# EAGLE design rcvr003 (EAGLE 6.2)
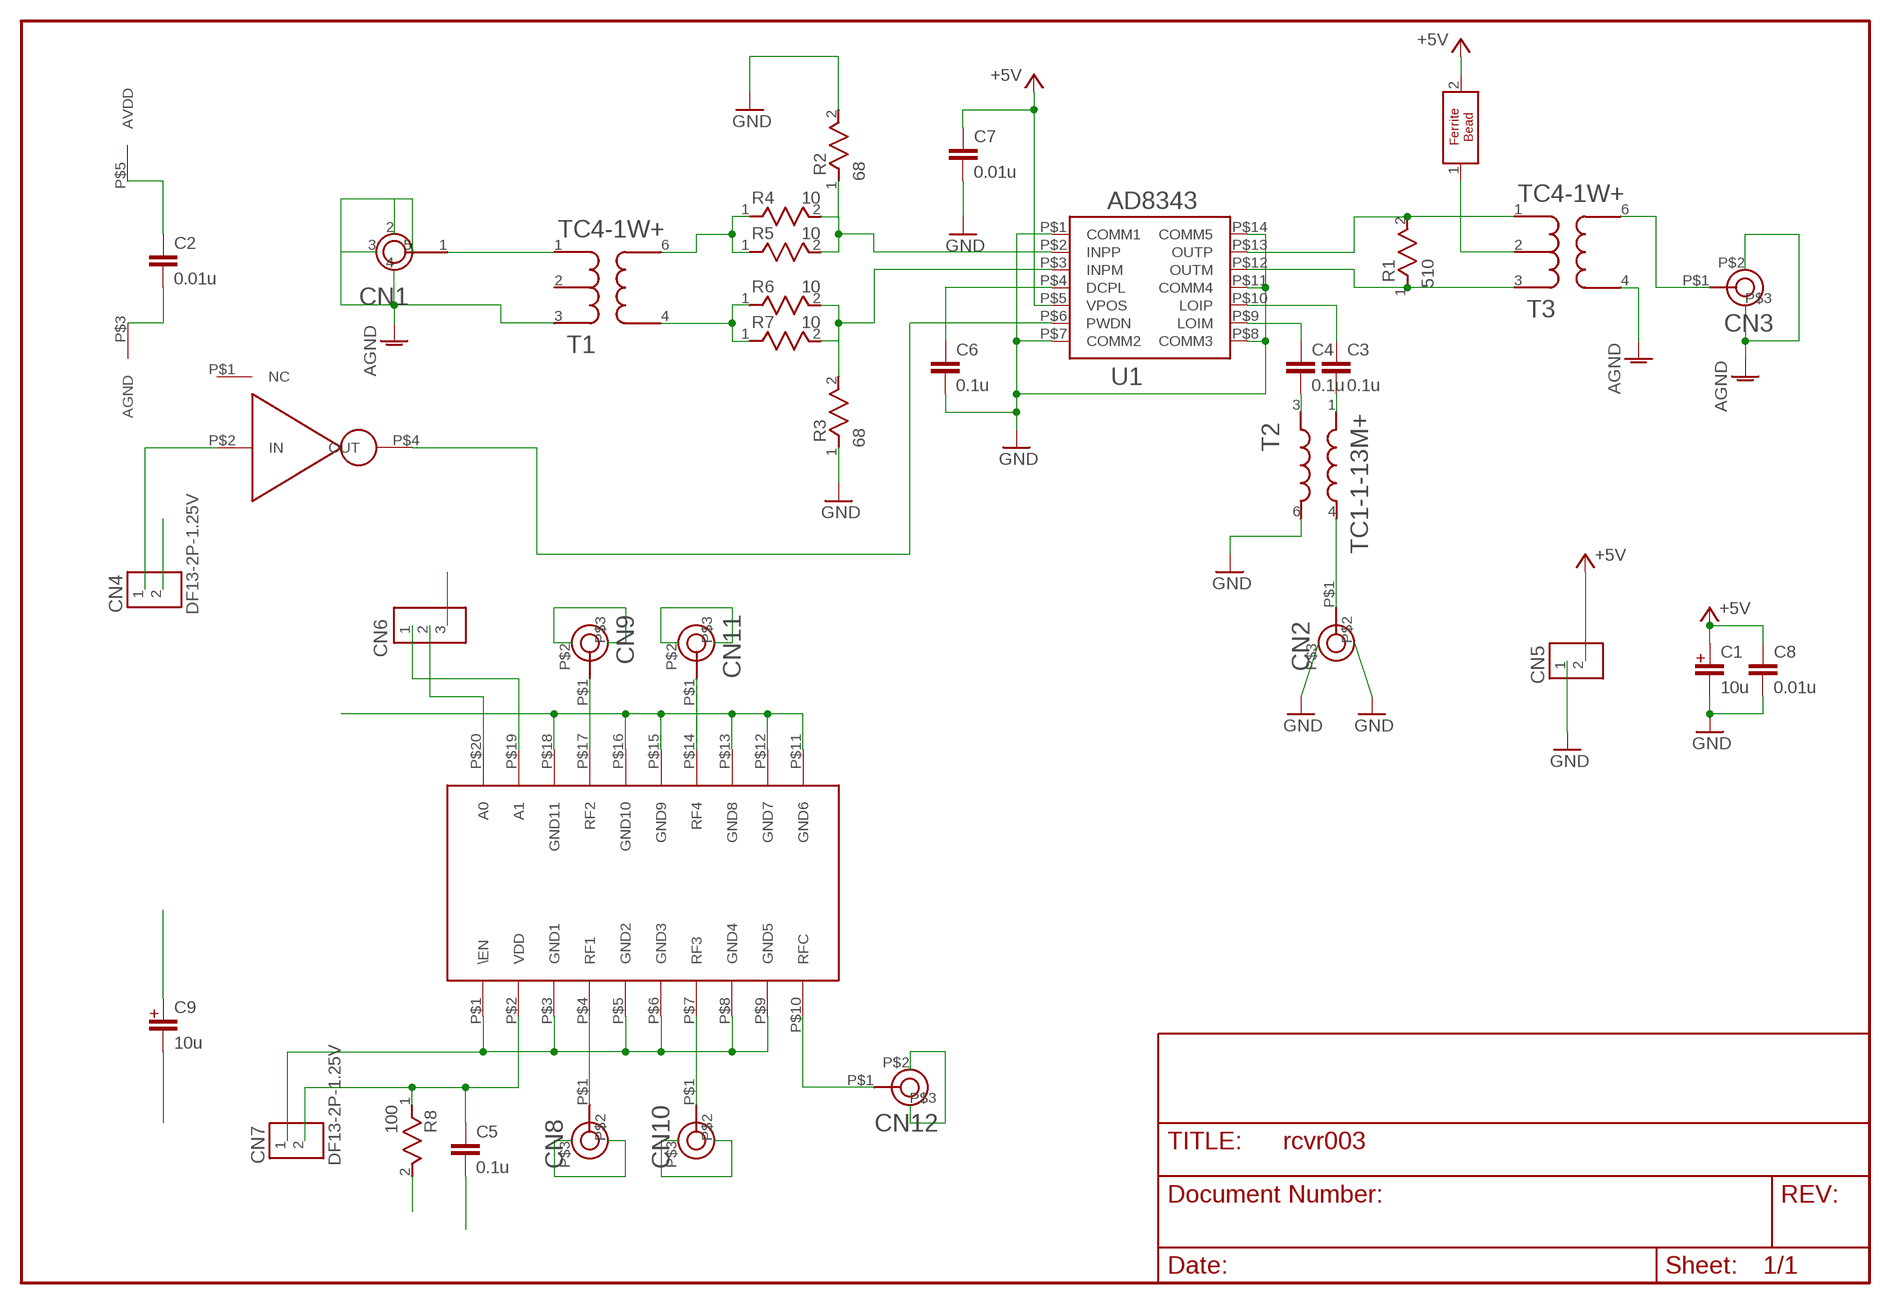
[diagram p0: schematic, sheet 1]

## Parts
C1  10u  C_POLAR3216  [3216_POLAR]
C2  0.01u  C1005  [1005]
C3  0.1u  C1005  [1005]
C4  0.1u  C1005  [1005]
C5  0.1u  C1005  [1005]
C6  0.1u  C1005  [1005]
C7  0.01u  C1005  [1005]
C8  0.01u  C1608  [1608]
C9  10u  C_POLAR3216  [3216_POLAR]
CN1  SMASTRAIGHT  [SMA_STRAIGHT]
CN2  U.FL-R-SMT  [U.FL-R-SMT]
CN3  U.FL-R-SMT  [U.FL-R-SMT]
CN4  DF13-2P-1.25V  [DF13-2P-12.5V]
CN5  DF13-2P-1.25V  [DF13-2P-12.5V]
CN6  DF13-3P-1.25V  [DF13-3P-1.25V]
CN7  DF13-2P-1.25V  [DF13-2P-12.5V]
CN8  U.FL-R-SMT  [U.FL-R-SMT]
CN9  U.FL-R-SMT  [U.FL-R-SMT]
CN10  U.FL-R-SMT  [U.FL-R-SMT]
CN11  U.FL-R-SMT  [U.FL-R-SMT]
CN12  U.FL-R-SMT  [U.FL-R-SMT]
FB2  FERRITEBEAD  [1608]
R1  510  R1608  [1608]
R2  68  R1608  [1608]
R3  68  R1608  [1608]
R4  10  R1005  [1005]
R5  10  R1005  [1005]
R6  10  R1005  [1005]
R7  10  R1005  [1005]
R8  100  R1608  [1608]
T1  TC4-1W+  [AT224]
T2  TC1-1-13M+  [AT224]
T3  TC4-1W+  [AT224]
U1  AD8343  [AD8343]
U2  MC74VHC1G04  [MC74VHC1G04]
U3  ADG904  [ADG904_TSSOP]

## Nets
3.3V: C5.1 C9.1 CN7.2 R8.1 U3.P$2(VDD)
+5V: C1.1 C2.1 C7.1 C8.1 CN5.2 FB2.2 U1.P$5(VPOS) U2.P$5(AVDD)
AGND: C1.2 C2.2 C6.2 C7.2 C8.2 CN1.2(GND) CN1.3(GND) CN1.4(GND) CN1.5(GND) CN2.P$2(AGND) CN2.P$3(AGND2) CN3.P$2(AGND) CN3.P$3(AGND2) CN4.2 CN5.1 R2.2 R3.1 T1.3 T2.6 T3.4 U1.P$1(COMM1) U1.P$7(COMM2) U1.P$8(COMM3) U1.P$11(COMM4) U1.P$14(COMM5) U2.P$3(AGND) ; supply symbol labelled GND
GND2: C5.2 C9.2 CN7.1 CN8.P$2(AGND) CN8.P$3(AGND2) CN9.P$2(AGND) CN9.P$3(AGND2) CN10.P$2(AGND) CN10.P$3(AGND2) CN11.P$2(AGND) CN11.P$3(AGND2) CN12.P$2(AGND) CN12.P$3(AGND2) U3.P$1(\EN) U3.P$3(GND1) U3.P$5(GND2) U3.P$6(GND3) U3.P$8(GND4) U3.P$9(GND5) U3.P$11(GND6) U3.P$12(GND7) U3.P$13(GND8) U3.P$15(GND9) U3.P$16(GND10) U3.P$18(GND11)
N2: R8.2
N$1: CN4.1 U2.P$2(IN)
N$2: CN12.P$1 U3.P$10(RFC)
N$3: CN10.P$1 U3.P$7(RF3)
N$4: CN8.P$1 U3.P$4(RF1)
N$5: CN9.P$1 U3.P$17(RF2)
N$6: CN11.P$1 U3.P$14(RF4)
N$7: CN6.3
N$8: CN6.2 U3.P$20(A0)
N$9: CN2.P$1 T2.4
N$10: CN1.1 T1.1
N$11: U1.P$6(PWDN) U2.P$4(OUT)
N$12: CN6.1 U3.P$19(A1)
N$13: CN3.P$1 T3.6
N$20: FB2.1 T3.2
N$21: R1.2 T3.1 U1.P$13(OUTP)
N$22: R1.1 T3.3 U1.P$12(OUTM)
N$23: C6.1 U1.P$4(DCPL)
N$24: C4.1 U1.P$9(LOIM)
N$25: C3.1 U1.P$10(LOIP)
N$27: C4.2 T2.3
N$28: C3.2 T2.1
N$31: R2.1 R4.2 R5.2 U1.P$2(INPP)
N$32: R3.2 R6.2 R7.2 U1.P$3(INPM)
N$33: R4.1 R5.1 T1.6
N$34: R6.1 R7.1 T1.4
Unconnected: T1.2 U2.P$1(NC)

## Library data of the parts
C1 C9 = capacitor:C_POLAR
C2-C8 = capacitor:C: CAPACITOR naming: grid - package width
CN1 = connector:SMA
CN2 CN3 CN8-CN12 = HIROSE:U.FL-R-SMT
CN4 CN5 CN7 = HIROSE:DF13-2P-1.25V
CN6 = HIROSE:DF13-3P-1.25V
FB2 = ferriteBead:FERRITEBEAD
R1-R8 = resistor:R
T1 T3 = miniCircuits:TC4-1W+
T2 = miniCircuits:TC1-1-13M+
U1 = AnalogDevices:AD8343
U2 = nmr:MC74VHC1G04
U3 = nmr:ADG904

## Board
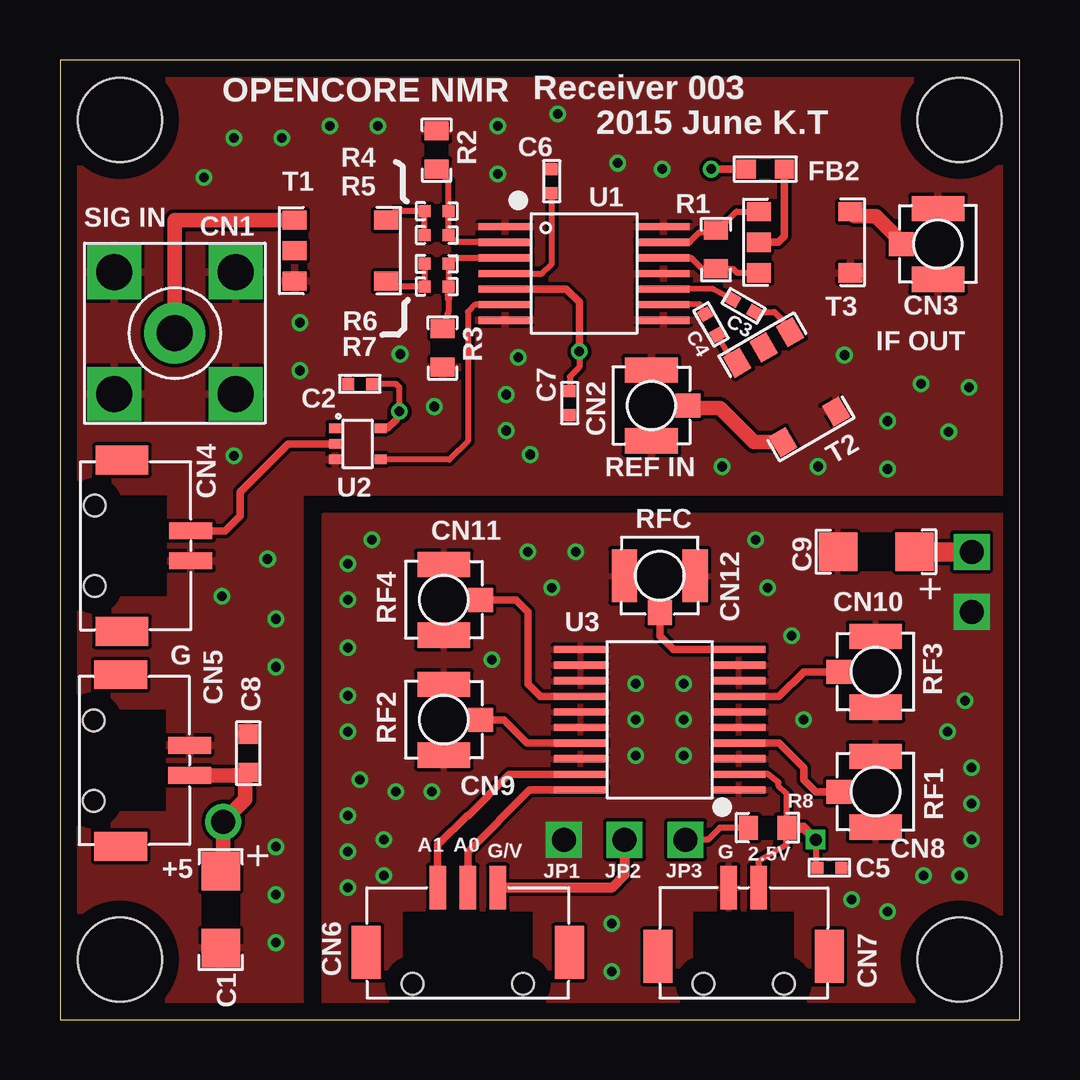
[diagram p1: board, top side]
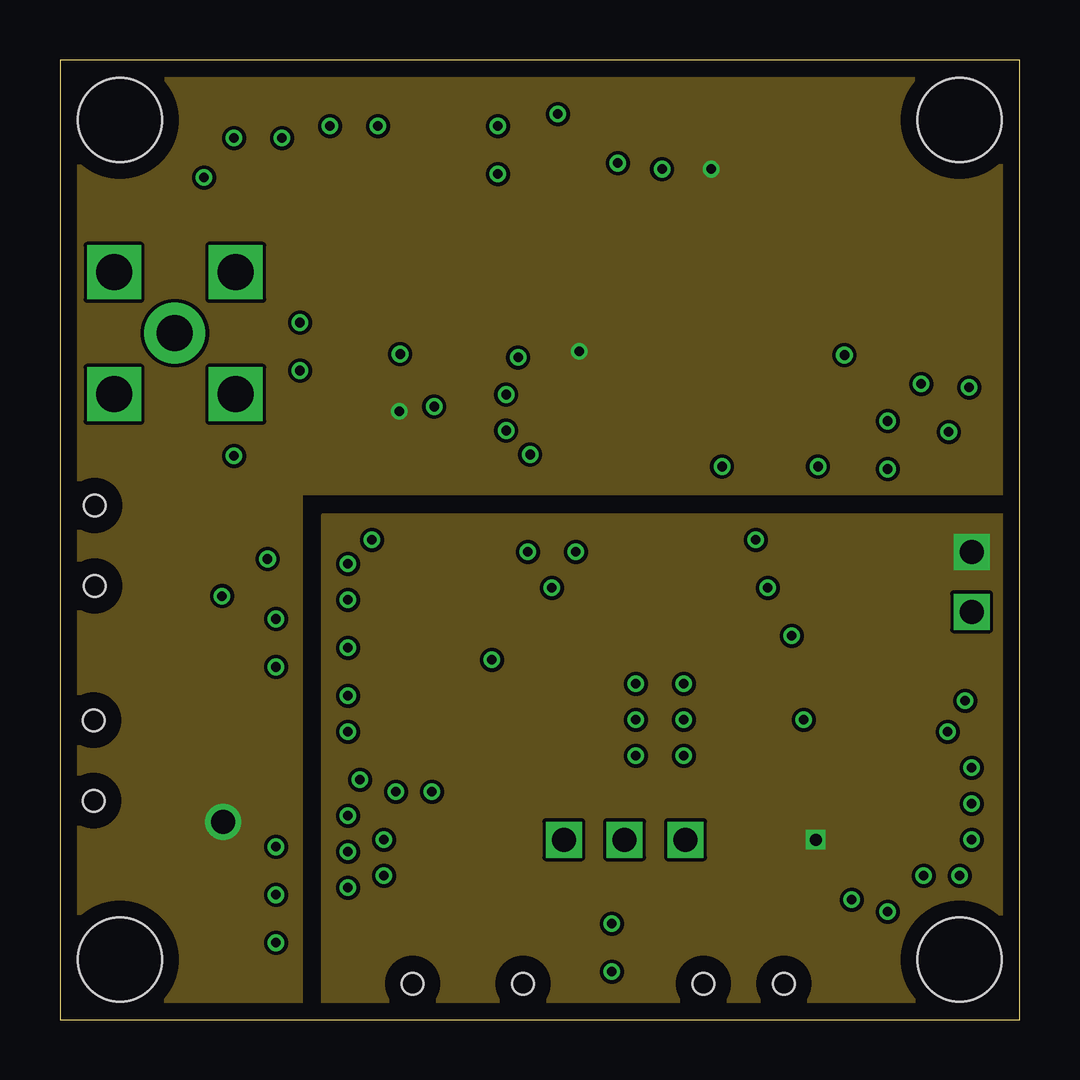
[diagram p2: board, inner layer Route2]
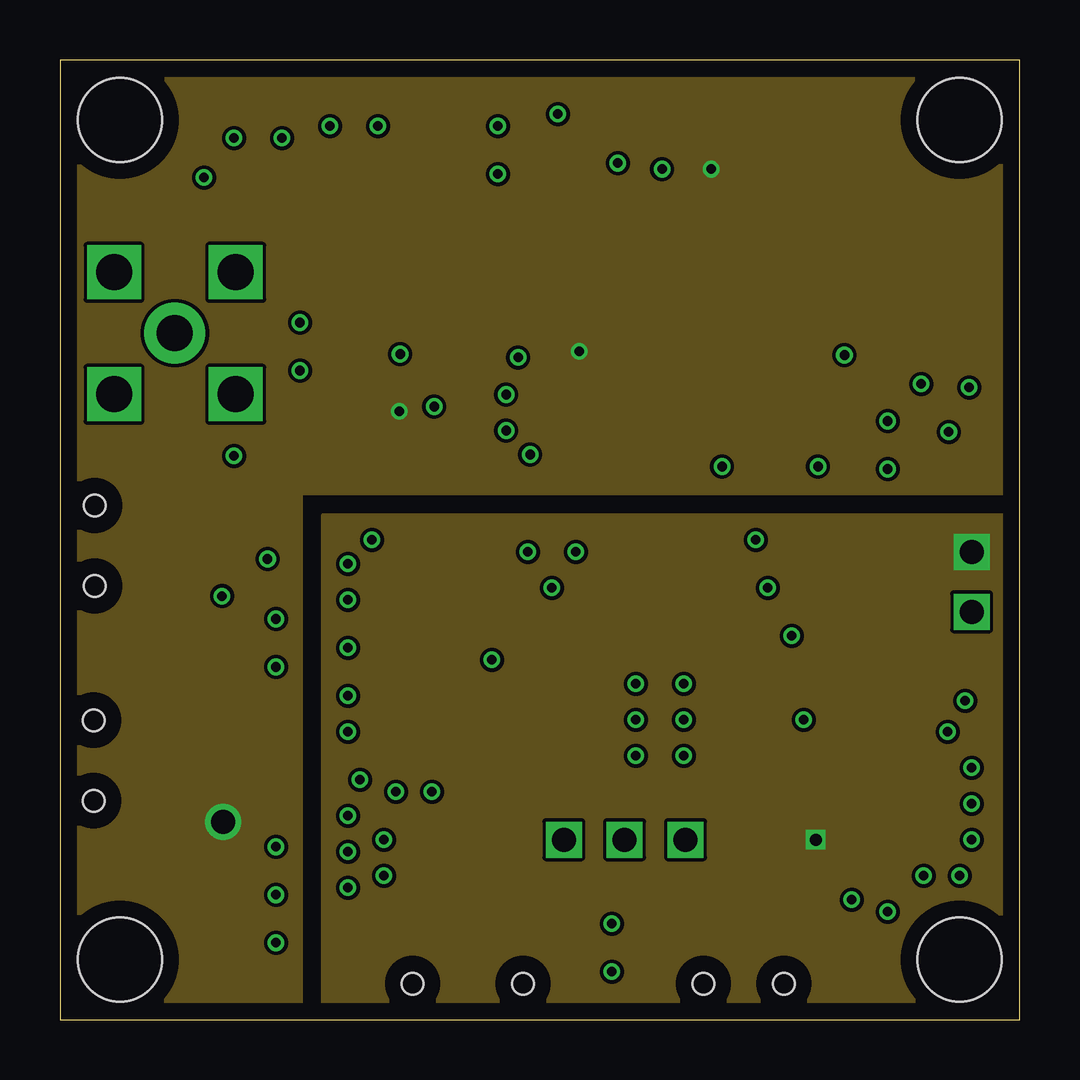
[diagram p3: board, inner layer Route3]
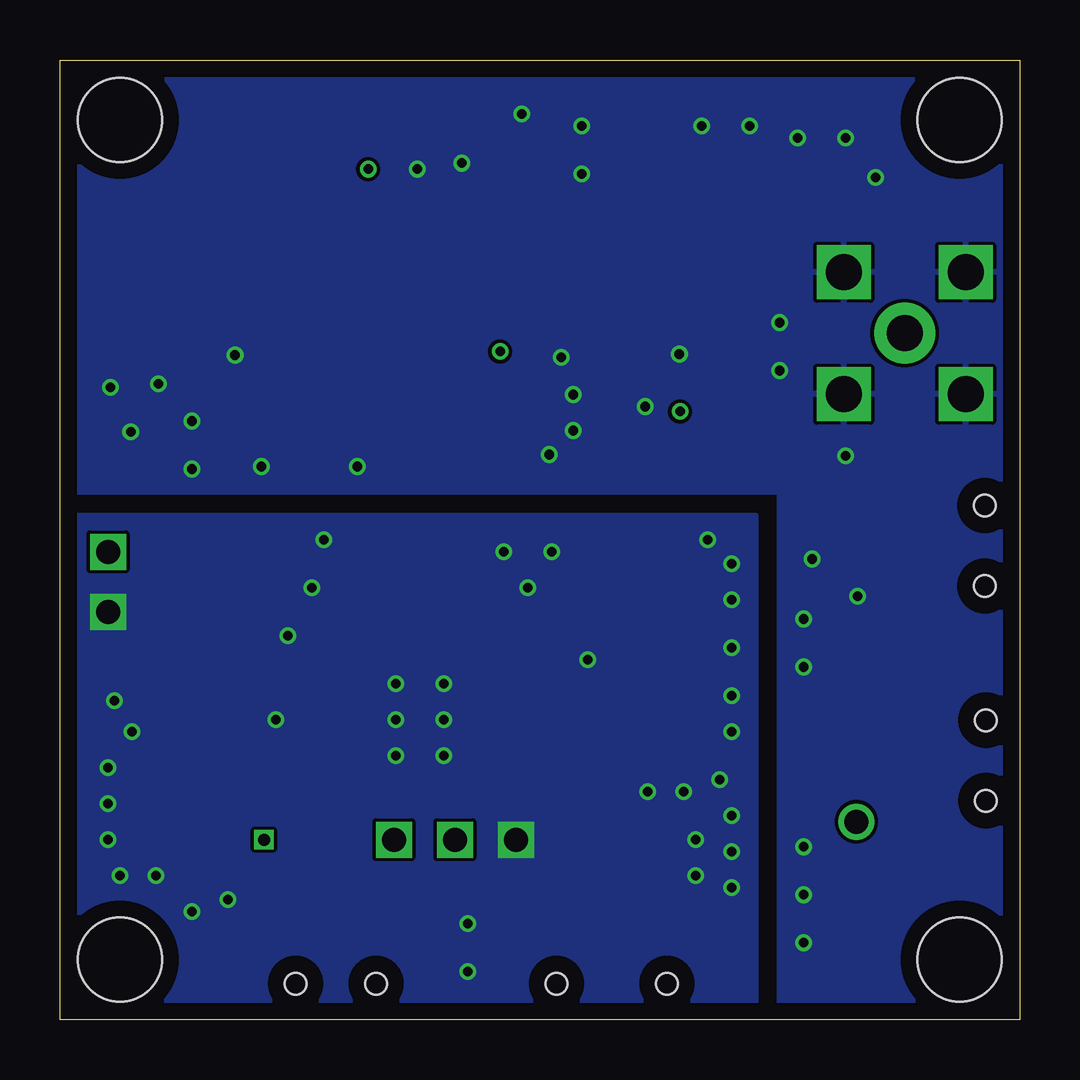
[diagram p4: board, bottom side, seen from below]

Size 40 x 40 mm. Coordinates in mm from the lower left corner, seen from the top.
Outline: 0,0 40,0 40,40 0,40 0,0
Copper layers (1*2*3*16): Top 0.035mm / dielectric 1.5mm / Route2 0.035mm / dielectric 0.15mm / Route3 0.035mm / dielectric 0.2mm / Bottom 0.035mm
Design rules: minimum track width 0.15mm, minimum drill 0.3mm, track to track 0.15mm, track to pad 0.15mm, pad to pad 0.15mm, via to via 0.15mm, smd to smd 0.15mm, copper to edge 0.7mm, drill to drill 0.45mm, minimum pad ring 0.15mm, minimum via ring 0.15mm, stop-mask expansion 4mil, vias tented up to drill 0mil, thermal gap 0.15mm
Holes 3.5 mm at 2.5,2.5 37.5,2.5 37.5,37.5 2.5,37.5

### Footprints (pad centres in the part's own frame; a part is rotated, then mirrored left to right if it is on the bottom)
3216_POLAR = smd 1.6 x 1.6: 1 -1.63,0; 2 1.57,0
1005 = smd 0.5 x 0.5: 1 -0.5,0; 2 0.5,0
1608 = smd 0.8 x 0.8: 1 -0.8,0; 2 0.8,0
SMA_STRAIGHT = drill 1.5 pad 2.54: 1 0,0 | drill 1.5 square: 2 -2.54,2.54; 3 2.54,2.54; 4 -2.54,-2.54; 5 2.54,-2.54
U.FL-R-SMT = smd 1 x 1.05: P$1 0,1.525 | smd 1.05 x 2.2: P$2 1.475,0; P$3 -1.475,0
DF13-2P-12.5V = smd 0.7 x 1.8: 1 -0.625,4; 2 0.625,4 | smd 1.2 x 2.2: 3 -3.575,1.13; 4 3.575,1.13 | hole 0.9: -1.675,0; 1.675,0
DF13-3P-1.25V = smd 0.7 x 1.8: 1 -1.25,4; 2 0,4; 3 1.25,4 | smd 1.2 x 2.2: 4 -4.235,1.3; 5 4.235,1.3 | hole 0.9: -2.3,0; 2.3,0
1608' = smd 0.8 x 1: 1 -0.8,0; 2 0.8,0
AT224 = smd 1 x 0.8: 1 -1.925,1.275; 2 -1.925,0; 3 -1.925,-1.275; 4 1.9,-1.275; 6 1.9,1.275
AD8343 = smd 2.2 x 0.3: P$1 -3.3,1.95; P$2 -3.3,1.3; P$3 -3.3,0.65; P$4 -3.3,0; P$5 -3.3,-0.65; P$6 -3.3,-1.3; P$7 -3.3,-1.95; P$8 3.3,-1.95; P$9 3.3,-1.3; P$10 3.3,-0.65; P$11 3.3,0; P$12 3.3,0.65; P$13 3.3,1.3; P$14 3.3,1.95
MC74VHC1G04 = smd 0.5 x 0.4: P$1 0,0; P$2 0,-0.65; P$3 0,-1.3; P$4 1.9,-1.3; P$5 1.9,0
ADG904_TSSOP = smd 0.3 x 2.2: P$1 -2.925,-3.3; P$2 -2.275,-3.3; P$3 -1.625,-3.3; P$4 -0.975,-3.3; P$5 -0.325,-3.3; P$6 0.325,-3.3; P$7 0.975,-3.3; P$8 1.625,-3.3; P$9 2.275,-3.3; P$10 2.925,-3.3; P$11 2.925,3.3; P$12 2.275,3.3; P$13 1.625,3.3; P$14 0.975,3.3; P$15 0.325,3.3; P$16 -0.325,3.3; P$17 -0.975,3.3; P$18 -1.625,3.3; P$19 -2.275,3.3; P$20 -2.925,3.3

### Placement (x,y rotation side)
C1  6.7,4.55 270 top
C2  12.5,26.5 180 top
C3  28.5,29.75 330 top
C4  27.14,28.98 300 top
C5  32.07,6.33 0 top
C6  20.5,34.95 90 top
C7  21.25,25.7 270 top
C8  7.85,11.1 90 top
C9  34,19.5 180 top
CN1  4.79,28.61 0 top
CN2  24.65,25.6 270 top
CN3  36.6,32.33 90 top
CN4  1.45,19.75 270 top
CN5  1.4,10.8 270 top
CN6  17,1.5 0 top
CN7  28.5,1.5 0 top
CN8  34,9.5 90 top
CN9  16,12.5 270 top
CN10  34,14.5 90 top
CN11  16,17.5 270 top
CN12  25,18.5 180 top
FB2  29.4,35.45 180 top
R1  510  [1608']  27.35,32.1 90 top
R2  68  [1608']  15.7,36.25 90 top
R3  68  [1608']  15.95,28 90 top
R4  15.7,33.7 0 top
R5  15.7,32.7 0 top
R6  15.7,31.5 0 top
R7  15.7,30.55 0 top
R8  100  [1608']  29.5,8 180 top
T1  11.7,32.05 0 top
T2  30.3,26.35 300 top
T3  31.05,32.4 0 top
U1  21.85,31.1 0 top
U2  11.46,24.65 0 top
U3  25,12.5 90 top

### Tracks (layer width: path | path; a pad name or v marks a point on that pad's centre or on a via)
3.3V  (via drill 0.5, 1)
  Top 0.254: 28.3,10.2 U3.P$2 29.52,10.23 29.95,9.88 29.95,9.74 30.3,9.41 R8.1 30.29,7.3 29.11,6.62 29.11,5.51 CN7.2 | v31.5,7.5 31.5,6.4 C5.1
  Top 0.406: v31.5,7.5 31,8 R8.1
  Top 0.61: 29.1,5.53 CN7.2
  Top 0.813: v38,19.5 C9.1
  pour Route2: 40,0 11,0 11,21 40,21
  pour Route3: 40,0 11,0 11,21 40,21
+5V  (via drill 0.4, 1)
  Top 0.254: v21.65,27.85 21.65,27.2 21.25,26.8 C7.1 | C7.1 | v14.15,25.35 14.15,26.35 14,26.5 C2.1
  Top 0.305: U1.P$5 21.1,30.45 21.65,29.9 v21.65,27.85 | U2.P$5 13.65,24.65 14,25 v14.15,25.35 | v27.15,35.45 FB2.2
  Top 0.406: v21.65,27.85 21.7,27.85
  Top 0.61: CN5.2 7.72,10.18 | 7.72,10.18 C8.1 | 7.72,10.18 7.72,9.18 v6.8,8.25 6.8,6.28 C1.1
  pour Route2: 0,0 10,0 10,22 40,22 40,40 0,40
  pour Route3: 0,0 10,0 10,22 40,22 40,40 0,40
AGND  (via drill 0.4)
  other vias: 6.75,17.65 19.6,23.55 9.25,36.75 37.05,24.5 10,29.05 8.65,19.2 34.5,24.95 32.7,27.7 25.1,35.45 7.25,23.5 23.25,35.7 9,3.2 35.9,26.5 6,35.1 19.1,27.6 37.9,26.35 9,5.2 9,7.2 9,14.7 9,16.7 10,27.05 27.6,23.05 31.6,23.05 34.5,22.95 18.6,26.05 18.6,24.55 11.25,37.25 7.25,36.75 13.25,37.25 18.25,37.25 18.25,35.25 20.75,37.75 14.18,27.74 15.6,25.55
  pour Bottom: 0,0 10,0 10,22 40,22 40,40 0,40
  pour Top: 0,40 40,40 40,22 10,22 10,0 0,0
GND2  (via drill 0.4 pad 0.61, 1, 1 pad 1.27)
  other vias: 23,2 34.5,4.5 37.73,13.29 33,5 13.5,6 12,8.5 23,4 21,7.5 30.5,16 36,6 37.5,6 37.5,6 38,7.5 38,9 38,10.5 37,12 29.5,18 29,20 21.5,19.5 20.5,18 19.5,19.5 15.5,9.5 13,20 12,19 12,17.5 12,15.5 12,13.5 12,12 12.5,10 14,9.5 13.5,7.5 12,7 12,5.5 18,15 31,12.5 24,14 26,14 26,12.5 26,11 24,11 24,12.5 38,17
  pour Top: 40,21 11,21 11,0 40,0
  pour Bottom: 40,0 11,0 11,21 40,21
N2  (via drill 1)
  Top 0.254: R8.2 27.5,8 27,7.5 v26.08,7.5
N$1
  Top 0.305: CN4.1 6.88,20.38 7.5,21 7.5,22 9.5,24 U2.P$2
N$2
  Top 0.305: U3.P$10 25.57,15.43 25,16 CN12.P$1
N$3
  Top 0.305: U3.P$7 29.98,13.47 31,14.5 CN10.P$1
N$4
  Top 0.305: U3.P$4 29.98,11.53 31,10.5 31,10 31.5,9.5 CN8.P$1
N$5
  Top 0.305: U3.P$17 19.48,11.53 18.5,12.5 CN9.P$1
N$6
  Top 0.305: U3.P$14 20.02,13.47 19.5,14 19.5,17 19,17.5 CN11.P$1
N$7  (via drill 1)
  Top 0.406: v23.54,7.5 23.54,6.04 23,5.5 CN6.3
N$8
  Top 0.305: U3.P$20 19.57,9.57 17,7 CN6.2
N$9
  Top 0.61: T2.4 28.93,24.07 27.5,25.5 26.27,25.5 CN2.P$1
N$10
  Top 0.15: 9.81,33.32 T1.1
  Top 0.406: CN1.1 4.78,28.81
  Top 0.61: 9.81,33.32 4.78,33.32 4.78,28.81
N$11
  Top 0.254: U1.P$6 17.3,29.8 17,29.5 17,24.12 16.22,23.34 U2.P$4
N$12
  Top 0.305: U3.P$19 18.73,10.22 17,8.5 16.96,8.5 15.74,7.28 CN6.1
N$13
  Top 0.61: CN3.P$1 35.08,32.42 34,33.5 33.12,33.5 T3.6
N$20
  Top 0.305: FB2.1 30.2,32.66 29.94,32.4 T3.2 | T3.2
N$21
  Top 0.254: U1.P$13 26.24,32.4 26.66,32.82 27.27,32.82 R1.2 27.42,32.9 28.2,33.68 T3.1
N$22
  Top 0.254: U1.P$12 26.32,31.75 26.77,31.3 R1.1 28.05,31.3 28.22,31.13 T3.3
N$23
  Top 0.254: U1.P$4 20.1,31.1 20.5,31.5 C6.1 | C6.1
N$24
  Top 0.254: C4.1 26.66,29.82 U1.P$9
N$25
  Top 0.254: C3.1 27.19,30.46 U1.P$10
N$27
  Top 0.254: T2.3 28.14,27.29 27.83,27.79 C4.2
N$28
  Top 0.254: C3.2 29.78,29.5 30.08,29.2 T2.1
N$31
  Top 0.254: U1.P$2 16.5,32.4 R5.2 R4.2 16.2,34.95 R2.1
N$32
  Top 0.254: U1.P$3 16.45,31.75 R6.2 R7.2 | R7.2 | 16.2,30.05 16.2,29.55 R3.2
  Top 0.305: 16.2,30.05 R7.2
N$33
  Top 0.254: R5.1 R4.1 13.97,33.7 T1.6
N$34
  Top 0.254: R6.1 R7.1 | R7.1 | R7.1 13.82,30.55 T1.4

### Text on the board
tPlace: OPENCORE NMR | Receiver 003 | 2015 June K.T | SIG IN | IF OUT | REF IN | RFC | U3 | RF4 | G | RF3 | RF2 | RF1 | A1 | A0 | G/V | G | 2.5V | +5 | JP1 | JP2 | JP3